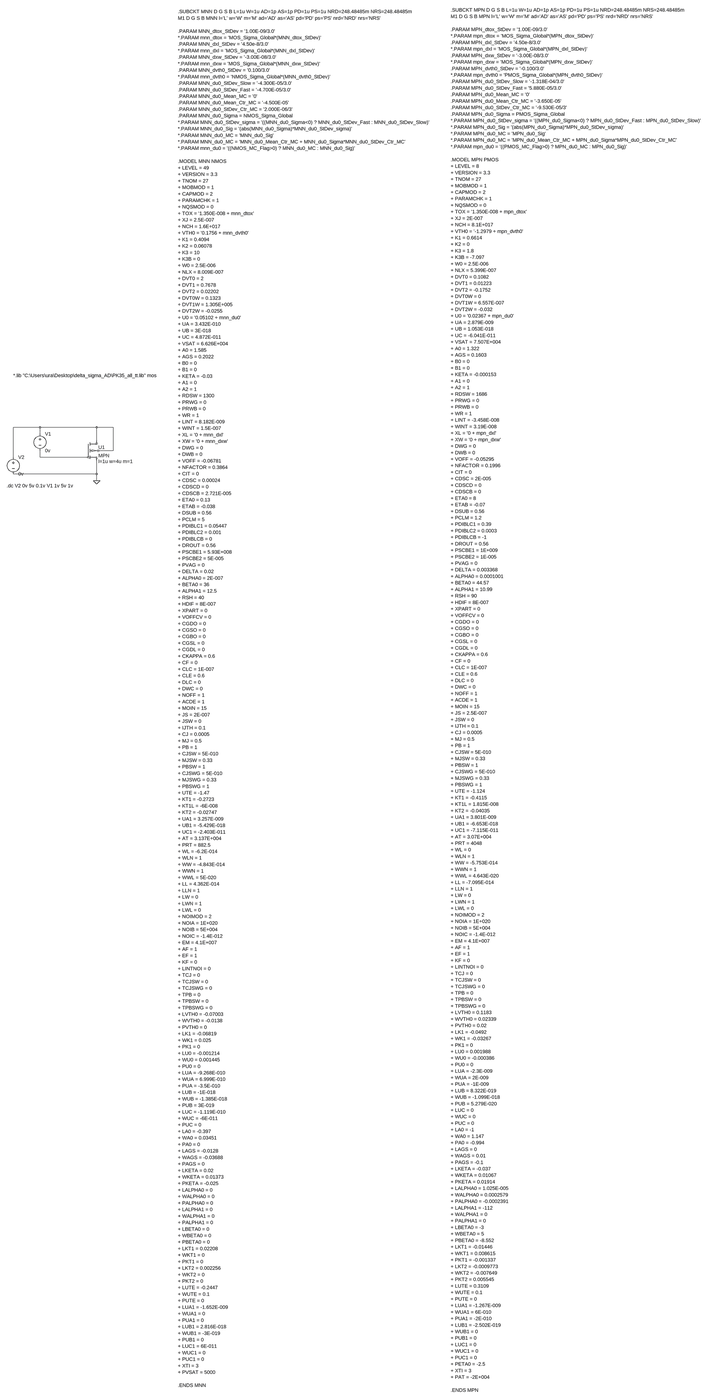
[diagram p0: schematic MPN_iv.asc, whole sheet]
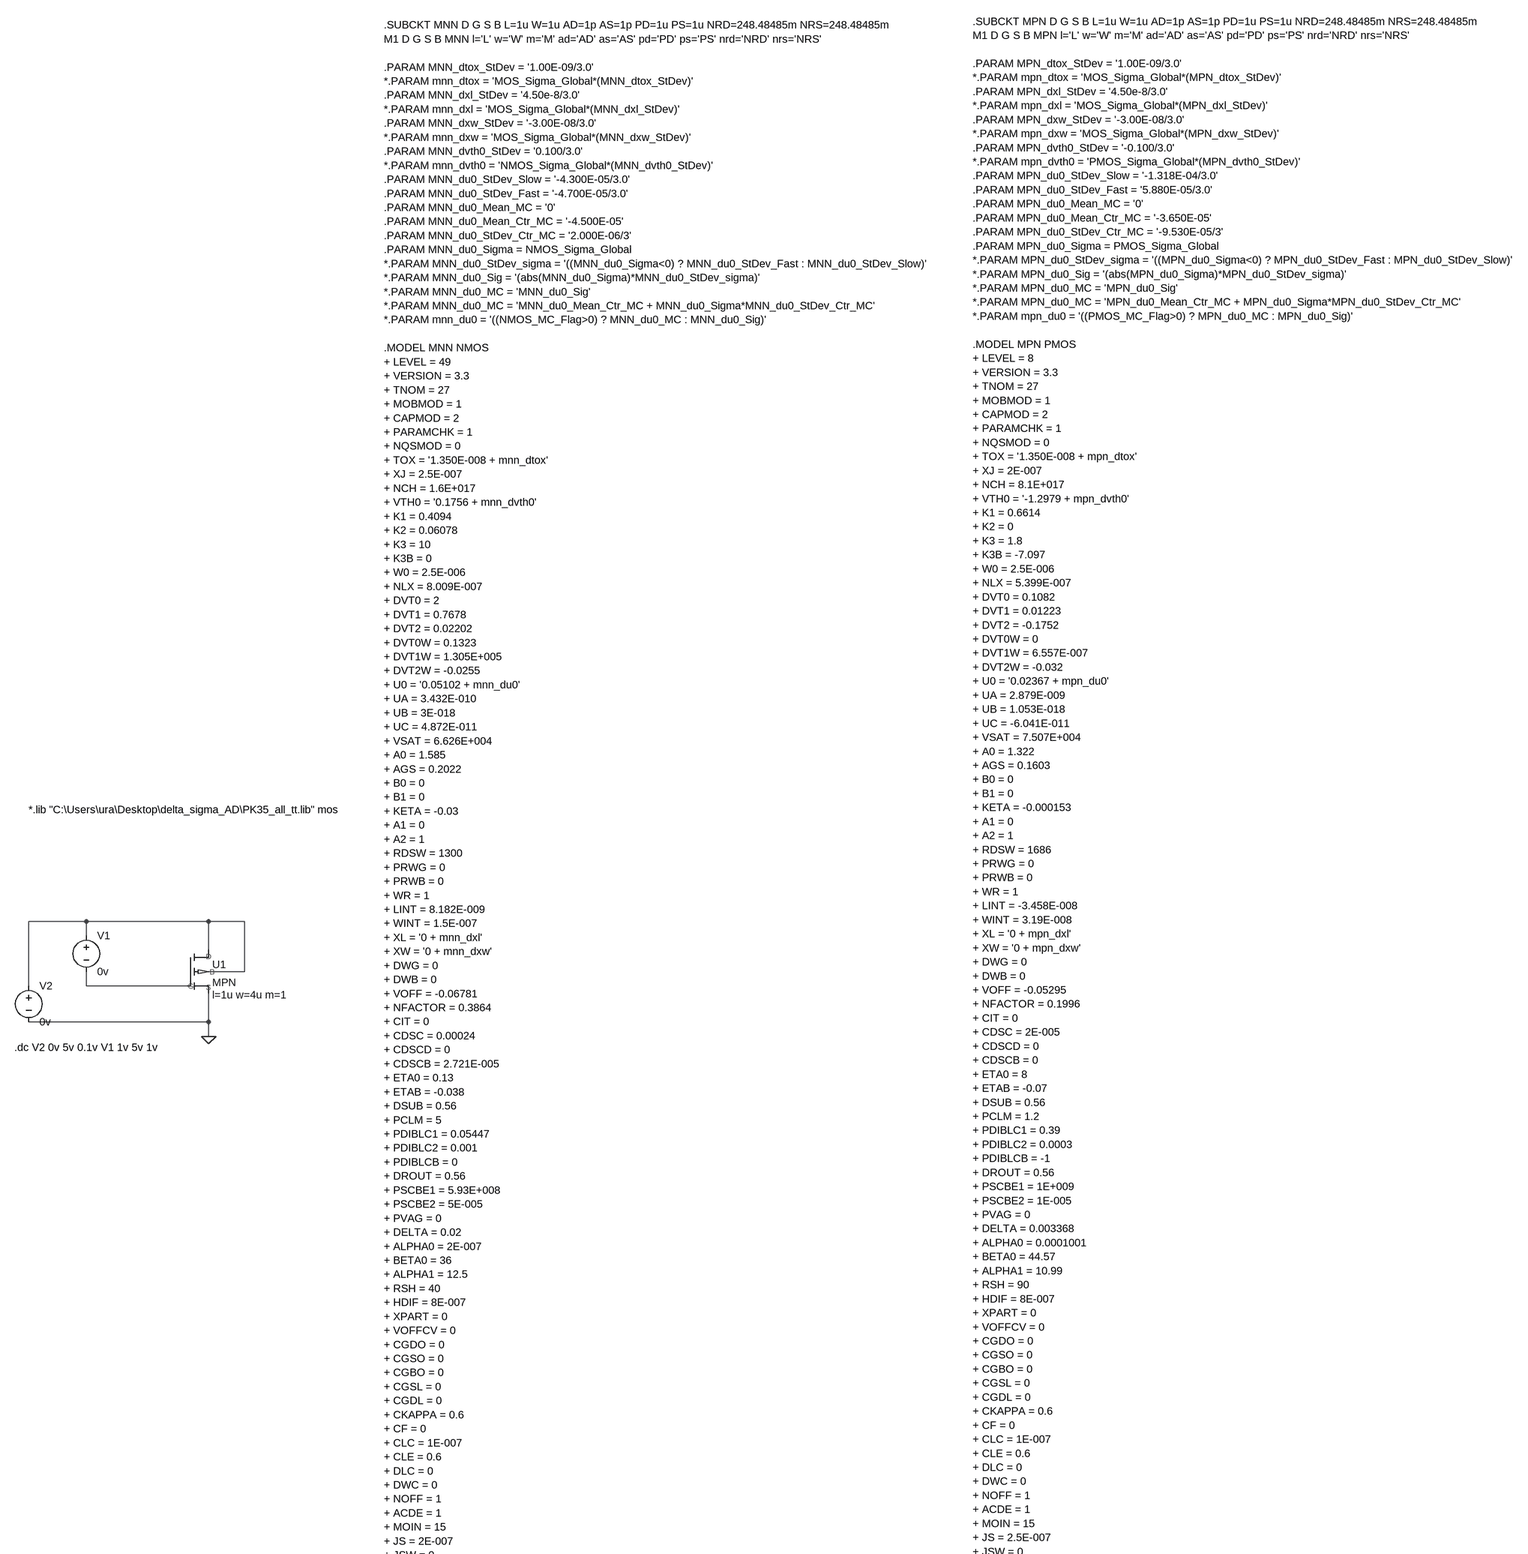
[diagram p1: schematic MPN_iv.asc, part, row 1 of 2, column 1 of 1]
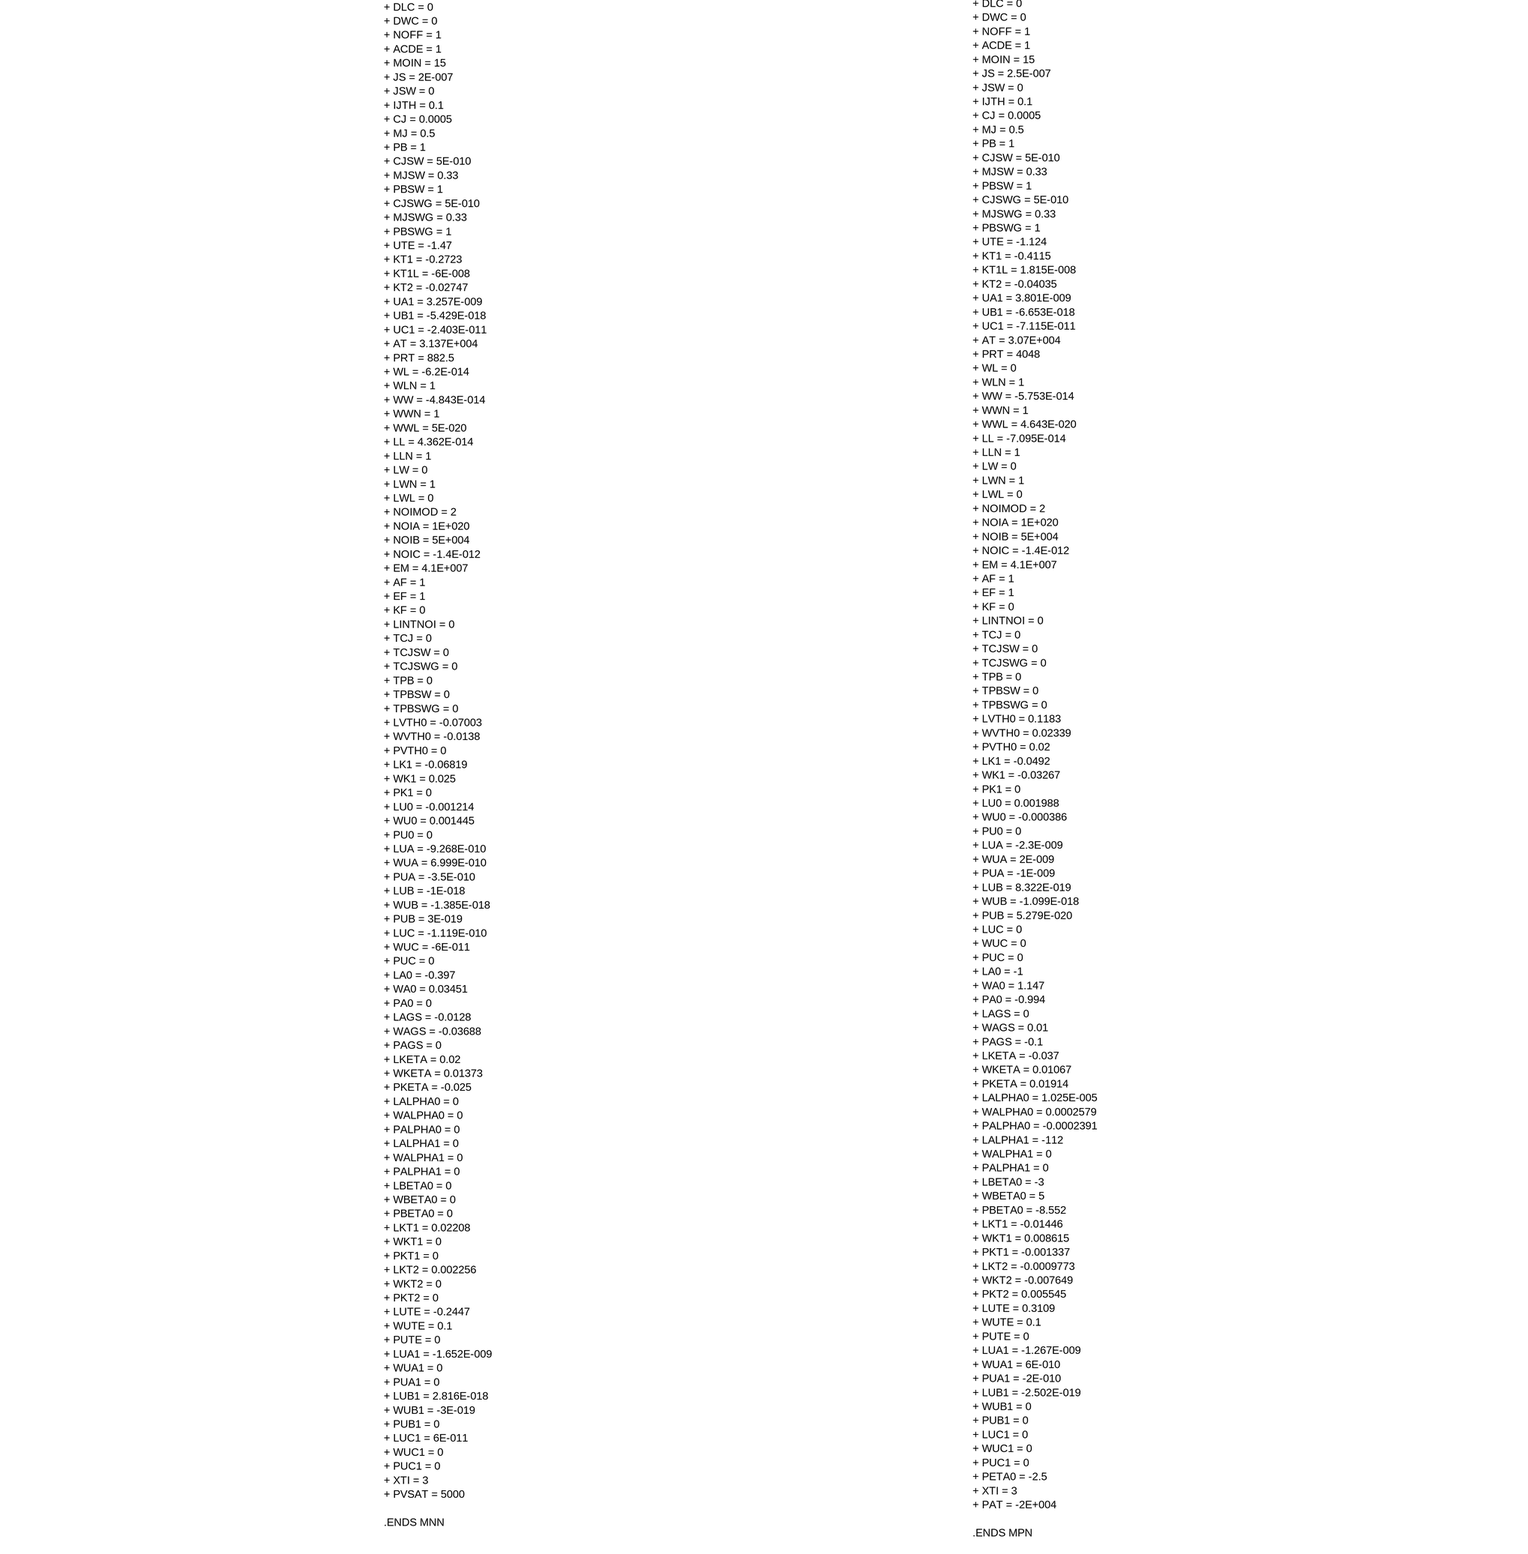
[diagram p2: schematic MPN_iv.asc, part, row 2 of 2, column 1 of 1]
MPN_iv.asc, the LTspice schematic file:
Version 4
SHEET 1 3700 4048
WIRE -160 96 -288 96
WIRE 112 96 -160 96
WIRE 192 96 112 96
WIRE -160 128 -160 96
WIRE 112 160 112 96
WIRE 192 208 192 96
WIRE 192 208 112 208
WIRE -288 240 -288 96
WIRE -160 240 -160 208
WIRE 64 240 -160 240
WIRE 112 320 112 256
WIRE 112 320 -288 320
WIRE 112 352 112 320
FLAG 112 352 0
SYMBOL voltage -160 112 R0
WINDOW 123 0 0 Left 0
WINDOW 39 0 0 Left 0
SYMATTR InstName V1
SYMATTR Value 0v
SYMBOL voltage -288 224 R0
WINDOW 123 0 0 Left 0
WINDOW 39 0 0 Left 0
SYMATTR InstName V2
SYMATTR Value 0v
SYMBOL MPN 96 208 R0
WINDOW 39 24 52 Left 2
SYMATTR InstName U1
SYMATTR SpiceLine l=1u w=4u m=1
TEXT -288 -152 Left 2 !*.lib "C:\\Users\\ura\\Desktop\\delta_sigma_AD\\PK35_all_tt.lib" mos
TEXT -320 376 Left 2 !.dc V2 0v 5v 0.1v V1 1v 5v 1v
TEXT 992 -1896 Left 2 !.SUBCKT MNN D G S B L=1u W=1u AD=1p AS=1p PD=1u PS=1u NRD=248.48485m NRS=248.48485m\nM1 D G S B MNN l='L' w='W' m='M' ad='AD' as='AS' pd='PD' ps='PS' nrd='NRD' nrs='NRS'\n \n.PARAM MNN_dtox_StDev = '1.00E-09/3.0'\n*.PARAM mnn_dtox = 'MOS_Sigma_Global*(MNN_dtox_StDev)'\n.PARAM MNN_dxl_StDev = '4.50e-8/3.0'\n*.PARAM mnn_dxl = 'MOS_Sigma_Global*(MNN_dxl_StDev)'\n.PARAM MNN_dxw_StDev = '-3.00E-08/3.0'\n*.PARAM mnn_dxw = 'MOS_Sigma_Global*(MNN_dxw_StDev)'\n.PARAM MNN_dvth0_StDev = '0.100/3.0'\n*.PARAM mnn_dvth0 = 'NMOS_Sigma_Global*(MNN_dvth0_StDev)'\n.PARAM MNN_du0_StDev_Slow = '-4.300E-05/3.0'\n.PARAM MNN_du0_StDev_Fast = '-4.700E-05/3.0'\n.PARAM MNN_du0_Mean_MC = '0'\n.PARAM MNN_du0_Mean_Ctr_MC = '-4.500E-05'\n.PARAM MNN_du0_StDev_Ctr_MC = '2.000E-06/3'\n.PARAM MNN_du0_Sigma = NMOS_Sigma_Global\n*.PARAM MNN_du0_StDev_sigma = '((MNN_du0_Sigma<0) ? MNN_du0_StDev_Fast : MNN_du0_StDev_Slow)'\n*.PARAM MNN_du0_Sig = '(abs(MNN_du0_Sigma)*MNN_du0_StDev_sigma)'\n*.PARAM MNN_du0_MC = 'MNN_du0_Sig'\n*.PARAM MNN_du0_MC = 'MNN_du0_Mean_Ctr_MC + MNN_du0_Sigma*MNN_du0_StDev_Ctr_MC'\n*.PARAM mnn_du0 = '((NMOS_MC_Flag>0) ? MNN_du0_MC : MNN_du0_Sig)'\n \n.MODEL MNN NMOS\n+ LEVEL = 49\n+ VERSION = 3.3\n+ TNOM = 27\n+ MOBMOD = 1\n+ CAPMOD = 2\n+ PARAMCHK = 1\n+ NQSMOD = 0\n+ TOX = '1.350E-008 + mnn_dtox'\n+ XJ = 2.5E-007\n+ NCH = 1.6E+017\n+ VTH0 = '0.1756 + mnn_dvth0'\n+ K1 = 0.4094\n+ K2 = 0.06078\n+ K3 = 10\n+ K3B = 0\n+ W0 = 2.5E-006\n+ NLX = 8.009E-007\n+ DVT0 = 2\n+ DVT1 = 0.7678\n+ DVT2 = 0.02202\n+ DVT0W = 0.1323\n+ DVT1W = 1.305E+005\n+ DVT2W = -0.0255\n+ U0 = '0.05102 + mnn_du0'\n+ UA = 3.432E-010\n+ UB = 3E-018\n+ UC = 4.872E-011\n+ VSAT = 6.626E+004\n+ A0 = 1.585\n+ AGS = 0.2022\n+ B0 = 0\n+ B1 = 0\n+ KETA = -0.03\n+ A1 = 0\n+ A2 = 1\n+ RDSW = 1300\n+ PRWG = 0\n+ PRWB = 0\n+ WR = 1\n+ LINT = 8.182E-009\n+ WINT = 1.5E-007\n+ XL = '0 + mnn_dxl'\n+ XW = '0 + mnn_dxw'\n+ DWG = 0\n+ DWB = 0\n+ VOFF = -0.06781\n+ NFACTOR = 0.3864\n+ CIT = 0\n+ CDSC = 0.00024\n+ CDSCD = 0\n+ CDSCB = 2.721E-005\n+ ETA0 = 0.13\n+ ETAB = -0.038\n+ DSUB = 0.56\n+ PCLM = 5\n+ PDIBLC1 = 0.05447\n+ PDIBLC2 = 0.001\n+ PDIBLCB = 0\n+ DROUT = 0.56\n+ PSCBE1 = 5.93E+008\n+ PSCBE2 = 5E-005\n+ PVAG = 0\n+ DELTA = 0.02\n+ ALPHA0 = 2E-007\n+ BETA0 = 36\n+ ALPHA1 = 12.5\n+ RSH = 40\n+ HDIF = 8E-007\n+ XPART = 0\n+ VOFFCV = 0\n+ CGDO = 0\n+ CGSO = 0\n+ CGBO = 0\n+ CGSL = 0\n+ CGDL = 0\n+ CKAPPA = 0.6\n+ CF = 0\n+ CLC = 1E-007\n+ CLE = 0.6\n+ DLC = 0\n+ DWC = 0\n+ NOFF = 1\n+ ACDE = 1\n+ MOIN = 15\n+ JS = 2E-007\n+ JSW = 0\n+ IJTH = 0.1\n+ CJ = 0.0005\n+ MJ = 0.5\n+ PB = 1\n+ CJSW = 5E-010\n+ MJSW = 0.33\n+ PBSW = 1\n+ CJSWG = 5E-010\n+ MJSWG = 0.33\n+ PBSWG = 1\n+ UTE = -1.47\n+ KT1 = -0.2723\n+ KT1L = -6E-008\n+ KT2 = -0.02747\n+ UA1 = 3.257E-009\n+ UB1 = -5.429E-018\n+ UC1 = -2.403E-011\n+ AT = 3.137E+004\n+ PRT = 882.5\n+ WL = -6.2E-014\n+ WLN = 1\n+ WW = -4.843E-014\n+ WWN = 1\n+ WWL = 5E-020\n+ LL = 4.362E-014\n+ LLN = 1\n+ LW = 0\n+ LWN = 1\n+ LWL = 0\n+ NOIMOD = 2\n+ NOIA = 1E+020\n+ NOIB = 5E+004\n+ NOIC = -1.4E-012\n+ EM = 4.1E+007\n+ AF = 1\n+ EF = 1\n+ KF = 0\n+ LINTNOI = 0\n+ TCJ = 0\n+ TCJSW = 0\n+ TCJSWG = 0\n+ TPB = 0\n+ TPBSW = 0\n+ TPBSWG = 0\n+ LVTH0 = -0.07003\n+ WVTH0 = -0.0138\n+ PVTH0 = 0\n+ LK1 = -0.06819\n+ WK1 = 0.025\n+ PK1 = 0\n+ LU0 = -0.001214\n+ WU0 = 0.001445\n+ PU0 = 0\n+ LUA = -9.268E-010\n+ WUA = 6.999E-010\n+ PUA = -3.5E-010\n+ LUB = -1E-018\n+ WUB = -1.385E-018\n+ PUB = 3E-019\n+ LUC = -1.119E-010\n+ WUC = -6E-011\n+ PUC = 0\n+ LA0 = -0.397\n+ WA0 = 0.03451\n+ PA0 = 0\n+ LAGS = -0.0128\n+ WAGS = -0.03688\n+ PAGS = 0\n+ LKETA = 0.02\n+ WKETA = 0.01373\n+ PKETA = -0.025\n+ LALPHA0 = 0\n+ WALPHA0 = 0\n+ PALPHA0 = 0\n+ LALPHA1 = 0\n+ WALPHA1 = 0\n+ PALPHA1 = 0\n+ LBETA0 = 0\n+ WBETA0 = 0\n+ PBETA0 = 0\n+ LKT1 = 0.02208\n+ WKT1 = 0\n+ PKT1 = 0\n+ LKT2 = 0.002256\n+ WKT2 = 0\n+ PKT2 = 0\n+ LUTE = -0.2447\n+ WUTE = 0.1\n+ PUTE = 0\n+ LUA1 = -1.652E-009\n+ WUA1 = 0\n+ PUA1 = 0\n+ LUB1 = 2.816E-018\n+ WUB1 = -3E-019\n+ PUB1 = 0\n+ LUC1 = 6E-011\n+ WUC1 = 0\n+ PUC1 = 0\n+ XTI = 3\n+ PVSAT = 5000\n \n.ENDS MNN
TEXT 2416 -1904 Left 2 !.SUBCKT MPN D G S B L=1u W=1u AD=1p AS=1p PD=1u PS=1u NRD=248.48485m NRS=248.48485m\nM1 D G S B MPN l='L' w='W' m='M' ad='AD' as='AS' pd='PD' ps='PS' nrd='NRD' nrs='NRS'\n \n.PARAM MPN_dtox_StDev = '1.00E-09/3.0'\n*.PARAM mpn_dtox = 'MOS_Sigma_Global*(MPN_dtox_StDev)'\n.PARAM MPN_dxl_StDev = '4.50e-8/3.0'\n*.PARAM mpn_dxl = 'MOS_Sigma_Global*(MPN_dxl_StDev)'\n.PARAM MPN_dxw_StDev = '-3.00E-08/3.0'\n*.PARAM mpn_dxw = 'MOS_Sigma_Global*(MPN_dxw_StDev)'\n.PARAM MPN_dvth0_StDev = '-0.100/3.0'\n*.PARAM mpn_dvth0 = 'PMOS_Sigma_Global*(MPN_dvth0_StDev)'\n.PARAM MPN_du0_StDev_Slow = '-1.318E-04/3.0'\n.PARAM MPN_du0_StDev_Fast = '5.880E-05/3.0'\n.PARAM MPN_du0_Mean_MC = '0'\n.PARAM MPN_du0_Mean_Ctr_MC = '-3.650E-05'\n.PARAM MPN_du0_StDev_Ctr_MC = '-9.530E-05/3'\n.PARAM MPN_du0_Sigma = PMOS_Sigma_Global\n*.PARAM MPN_du0_StDev_sigma = '((MPN_du0_Sigma<0) ? MPN_du0_StDev_Fast : MPN_du0_StDev_Slow)'\n*.PARAM MPN_du0_Sig = '(abs(MPN_du0_Sigma)*MPN_du0_StDev_sigma)'\n*.PARAM MPN_du0_MC = 'MPN_du0_Sig'\n*.PARAM MPN_du0_MC = 'MPN_du0_Mean_Ctr_MC + MPN_du0_Sigma*MPN_du0_StDev_Ctr_MC'\n*.PARAM mpn_du0 = '((PMOS_MC_Flag>0) ? MPN_du0_MC : MPN_du0_Sig)'\n \n.MODEL MPN PMOS\n+ LEVEL = 8\n+ VERSION = 3.3\n+ TNOM = 27\n+ MOBMOD = 1\n+ CAPMOD = 2\n+ PARAMCHK = 1\n+ NQSMOD = 0\n+ TOX = '1.350E-008 + mpn_dtox'\n+ XJ = 2E-007\n+ NCH = 8.1E+017\n+ VTH0 = '-1.2979 + mpn_dvth0'\n+ K1 = 0.6614\n+ K2 = 0\n+ K3 = 1.8\n+ K3B = -7.097\n+ W0 = 2.5E-006\n+ NLX = 5.399E-007\n+ DVT0 = 0.1082\n+ DVT1 = 0.01223\n+ DVT2 = -0.1752\n+ DVT0W = 0\n+ DVT1W = 6.557E-007\n+ DVT2W = -0.032\n+ U0 = '0.02367 + mpn_du0'\n+ UA = 2.879E-009\n+ UB = 1.053E-018\n+ UC = -6.041E-011\n+ VSAT = 7.507E+004\n+ A0 = 1.322\n+ AGS = 0.1603\n+ B0 = 0\n+ B1 = 0\n+ KETA = -0.000153\n+ A1 = 0\n+ A2 = 1\n+ RDSW = 1686\n+ PRWG = 0\n+ PRWB = 0\n+ WR = 1\n+ LINT = -3.458E-008\n+ WINT = 3.19E-008\n+ XL = '0 + mpn_dxl'\n+ XW = '0 + mpn_dxw'\n+ DWG = 0\n+ DWB = 0\n+ VOFF = -0.05295\n+ NFACTOR = 0.1996\n+ CIT = 0\n+ CDSC = 2E-005\n+ CDSCD = 0\n+ CDSCB = 0\n+ ETA0 = 8\n+ ETAB = -0.07\n+ DSUB = 0.56\n+ PCLM = 1.2\n+ PDIBLC1 = 0.39\n+ PDIBLC2 = 0.0003\n+ PDIBLCB = -1\n+ DROUT = 0.56\n+ PSCBE1 = 1E+009\n+ PSCBE2 = 1E-005\n+ PVAG = 0\n+ DELTA = 0.003368\n+ ALPHA0 = 0.0001001\n+ BETA0 = 44.57\n+ ALPHA1 = 10.99\n+ RSH = 90\n+ HDIF = 8E-007\n+ XPART = 0\n+ VOFFCV = 0\n+ CGDO = 0\n+ CGSO = 0\n+ CGBO = 0\n+ CGSL = 0\n+ CGDL = 0\n+ CKAPPA = 0.6\n+ CF = 0\n+ CLC = 1E-007\n+ CLE = 0.6\n+ DLC = 0\n+ DWC = 0\n+ NOFF = 1\n+ ACDE = 1\n+ MOIN = 15\n+ JS = 2.5E-007\n+ JSW = 0\n+ IJTH = 0.1\n+ CJ = 0.0005\n+ MJ = 0.5\n+ PB = 1\n+ CJSW = 5E-010\n+ MJSW = 0.33\n+ PBSW = 1\n+ CJSWG = 5E-010\n+ MJSWG = 0.33\n+ PBSWG = 1\n+ UTE = -1.124\n+ KT1 = -0.4115\n+ KT1L = 1.815E-008\n+ KT2 = -0.04035\n+ UA1 = 3.801E-009\n+ UB1 = -6.653E-018\n+ UC1 = -7.115E-011\n+ AT = 3.07E+004\n+ PRT = 4048\n+ WL = 0\n+ WLN = 1\n+ WW = -5.753E-014\n+ WWN = 1\n+ WWL = 4.643E-020\n+ LL = -7.095E-014\n+ LLN = 1\n+ LW = 0\n+ LWN = 1\n+ LWL = 0\n+ NOIMOD = 2\n+ NOIA = 1E+020\n+ NOIB = 5E+004\n+ NOIC = -1.4E-012\n+ EM = 4.1E+007\n+ AF = 1\n+ EF = 1\n+ KF = 0\n+ LINTNOI = 0\n+ TCJ = 0\n+ TCJSW = 0\n+ TCJSWG = 0\n+ TPB = 0\n+ TPBSW = 0\n+ TPBSWG = 0\n+ LVTH0 = 0.1183\n+ WVTH0 = 0.02339\n+ PVTH0 = 0.02\n+ LK1 = -0.0492\n+ WK1 = -0.03267\n+ PK1 = 0\n+ LU0 = 0.001988\n+ WU0 = -0.000386\n+ PU0 = 0\n+ LUA = -2.3E-009\n+ WUA = 2E-009\n+ PUA = -1E-009\n+ LUB = 8.322E-019\n+ WUB = -1.099E-018\n+ PUB = 5.279E-020\n+ LUC = 0\n+ WUC = 0\n+ PUC = 0\n+ LA0 = -1\n+ WA0 = 1.147\n+ PA0 = -0.994\n+ LAGS = 0\n+ WAGS = 0.01\n+ PAGS = -0.1\n+ LKETA = -0.037\n+ WKETA = 0.01067\n+ PKETA = 0.01914\n+ LALPHA0 = 1.025E-005\n+ WALPHA0 = 0.0002579\n+ PALPHA0 = -0.0002391\n+ LALPHA1 = -112\n+ WALPHA1 = 0\n+ PALPHA1 = 0\n+ LBETA0 = -3\n+ WBETA0 = 5\n+ PBETA0 = -8.552\n+ LKT1 = -0.01446\n+ WKT1 = 0.008615\n+ PKT1 = -0.001337\n+ LKT2 = -0.0009773\n+ WKT2 = -0.007649\n+ PKT2 = 0.005545\n+ LUTE = 0.3109\n+ WUTE = 0.1\n+ PUTE = 0\n+ LUA1 = -1.267E-009\n+ WUA1 = 6E-010\n+ PUA1 = -2E-010\n+ LUB1 = -2.502E-019\n+ WUB1 = 0\n+ PUB1 = 0\n+ LUC1 = 0\n+ WUC1 = 0\n+ PUC1 = 0\n+ PETA0 = -2.5\n+ XTI = 3\n+ PAT = -2E+004\n \n.ENDS MPN

The netlist it stands for:
* MPN_iv.asc
V1 N001 N002 0v
V2 N001 0 0v
XU1 N001 N002 0 N001 MPN l=1u w=4u m=1  ; pins D G S B
*.lib "C:\Users\ura\Desktop\delta_sigma_AD\PK35_all_tt.lib" mos
.dc V2 0v 5v 0.1v V1 1v 5v 1v
.SUBCKT MNN D G S B L=1u W=1u AD=1p AS=1p PD=1u PS=1u NRD=248.48485m NRS=248.48485m
M1 D G S B MNN l='L' w='W' m='M' ad='AD' as='AS' pd='PD' ps='PS' nrd='NRD' nrs='NRS'
.PARAM MNN_dtox_StDev = '1.00E-09/3.0'
*.PARAM mnn_dtox = 'MOS_Sigma_Global*(MNN_dtox_StDev)'
.PARAM MNN_dxl_StDev = '4.50e-8/3.0'
*.PARAM mnn_dxl = 'MOS_Sigma_Global*(MNN_dxl_StDev)'
.PARAM MNN_dxw_StDev = '-3.00E-08/3.0'
*.PARAM mnn_dxw = 'MOS_Sigma_Global*(MNN_dxw_StDev)'
.PARAM MNN_dvth0_StDev = '0.100/3.0'
*.PARAM mnn_dvth0 = 'NMOS_Sigma_Global*(MNN_dvth0_StDev)'
.PARAM MNN_du0_StDev_Slow = '-4.300E-05/3.0'
.PARAM MNN_du0_StDev_Fast = '-4.700E-05/3.0'
.PARAM MNN_du0_Mean_MC = '0'
.PARAM MNN_du0_Mean_Ctr_MC = '-4.500E-05'
.PARAM MNN_du0_StDev_Ctr_MC = '2.000E-06/3'
.PARAM MNN_du0_Sigma = NMOS_Sigma_Global
*.PARAM MNN_du0_StDev_sigma = '((MNN_du0_Sigma<0) ? MNN_du0_StDev_Fast : MNN_du0_StDev_Slow)'
*.PARAM MNN_du0_Sig = '(abs(MNN_du0_Sigma)*MNN_du0_StDev_sigma)'
*.PARAM MNN_du0_MC = 'MNN_du0_Sig'
*.PARAM MNN_du0_MC = 'MNN_du0_Mean_Ctr_MC + MNN_du0_Sigma*MNN_du0_StDev_Ctr_MC'
*.PARAM mnn_du0 = '((NMOS_MC_Flag>0) ? MNN_du0_MC : MNN_du0_Sig)'
.MODEL MNN NMOS
+ LEVEL = 49
+ VERSION = 3.3
+ TNOM = 27
+ MOBMOD = 1
+ CAPMOD = 2
+ PARAMCHK = 1
+ NQSMOD = 0
+ TOX = '1.350E-008 + mnn_dtox'
+ XJ = 2.5E-007
+ NCH = 1.6E+017
+ VTH0 = '0.1756 + mnn_dvth0'
+ K1 = 0.4094
+ K2 = 0.06078
+ K3 = 10
+ K3B = 0
+ W0 = 2.5E-006
+ NLX = 8.009E-007
+ DVT0 = 2
+ DVT1 = 0.7678
+ DVT2 = 0.02202
+ DVT0W = 0.1323
+ DVT1W = 1.305E+005
+ DVT2W = -0.0255
+ U0 = '0.05102 + mnn_du0'
+ UA = 3.432E-010
+ UB = 3E-018
+ UC = 4.872E-011
+ VSAT = 6.626E+004
+ A0 = 1.585
+ AGS = 0.2022
+ B0 = 0
+ B1 = 0
+ KETA = -0.03
+ A1 = 0
+ A2 = 1
+ RDSW = 1300
+ PRWG = 0
+ PRWB = 0
+ WR = 1
+ LINT = 8.182E-009
+ WINT = 1.5E-007
+ XL = '0 + mnn_dxl'
+ XW = '0 + mnn_dxw'
+ DWG = 0
+ DWB = 0
+ VOFF = -0.06781
+ NFACTOR = 0.3864
+ CIT = 0
+ CDSC = 0.00024
+ CDSCD = 0
+ CDSCB = 2.721E-005
+ ETA0 = 0.13
+ ETAB = -0.038
+ DSUB = 0.56
+ PCLM = 5
+ PDIBLC1 = 0.05447
+ PDIBLC2 = 0.001
+ PDIBLCB = 0
+ DROUT = 0.56
+ PSCBE1 = 5.93E+008
+ PSCBE2 = 5E-005
+ PVAG = 0
+ DELTA = 0.02
+ ALPHA0 = 2E-007
+ BETA0 = 36
+ ALPHA1 = 12.5
+ RSH = 40
+ HDIF = 8E-007
+ XPART = 0
+ VOFFCV = 0
+ CGDO = 0
+ CGSO = 0
+ CGBO = 0
+ CGSL = 0
+ CGDL = 0
+ CKAPPA = 0.6
+ CF = 0
+ CLC = 1E-007
+ CLE = 0.6
+ DLC = 0
+ DWC = 0
+ NOFF = 1
+ ACDE = 1
+ MOIN = 15
+ JS = 2E-007
+ JSW = 0
+ IJTH = 0.1
+ CJ = 0.0005
+ MJ = 0.5
+ PB = 1
+ CJSW = 5E-010
+ MJSW = 0.33
+ PBSW = 1
+ CJSWG = 5E-010
+ MJSWG = 0.33
+ PBSWG = 1
+ UTE = -1.47
+ KT1 = -0.2723
+ KT1L = -6E-008
+ KT2 = -0.02747
+ UA1 = 3.257E-009
+ UB1 = -5.429E-018
+ UC1 = -2.403E-011
+ AT = 3.137E+004
+ PRT = 882.5
+ WL = -6.2E-014
+ WLN = 1
+ WW = -4.843E-014
+ WWN = 1
+ WWL = 5E-020
+ LL = 4.362E-014
+ LLN = 1
+ LW = 0
+ LWN = 1
+ LWL = 0
+ NOIMOD = 2
+ NOIA = 1E+020
+ NOIB = 5E+004
+ NOIC = -1.4E-012
+ EM = 4.1E+007
+ AF = 1
+ EF = 1
+ KF = 0
+ LINTNOI = 0
+ TCJ = 0
+ TCJSW = 0
+ TCJSWG = 0
+ TPB = 0
+ TPBSW = 0
+ TPBSWG = 0
+ LVTH0 = -0.07003
+ WVTH0 = -0.0138
+ PVTH0 = 0
+ LK1 = -0.06819
+ WK1 = 0.025
+ PK1 = 0
+ LU0 = -0.001214
+ WU0 = 0.001445
+ PU0 = 0
+ LUA = -9.268E-010
+ WUA = 6.999E-010
+ PUA = -3.5E-010
+ LUB = -1E-018
+ WUB = -1.385E-018
+ PUB = 3E-019
+ LUC = -1.119E-010
+ WUC = -6E-011
+ PUC = 0
+ LA0 = -0.397
+ WA0 = 0.03451
+ PA0 = 0
+ LAGS = -0.0128
+ WAGS = -0.03688
+ PAGS = 0
+ LKETA = 0.02
+ WKETA = 0.01373
+ PKETA = -0.025
+ LALPHA0 = 0
+ WALPHA0 = 0
+ PALPHA0 = 0
+ LALPHA1 = 0
+ WALPHA1 = 0
+ PALPHA1 = 0
+ LBETA0 = 0
+ WBETA0 = 0
+ PBETA0 = 0
+ LKT1 = 0.02208
+ WKT1 = 0
+ PKT1 = 0
+ LKT2 = 0.002256
+ WKT2 = 0
+ PKT2 = 0
+ LUTE = -0.2447
+ WUTE = 0.1
+ PUTE = 0
+ LUA1 = -1.652E-009
+ WUA1 = 0
+ PUA1 = 0
+ LUB1 = 2.816E-018
+ WUB1 = -3E-019
+ PUB1 = 0
+ LUC1 = 6E-011
+ WUC1 = 0
+ PUC1 = 0
+ XTI = 3
+ PVSAT = 5000
.ENDS MNN
.SUBCKT MPN D G S B L=1u W=1u AD=1p AS=1p PD=1u PS=1u NRD=248.48485m NRS=248.48485m
M1 D G S B MPN l='L' w='W' m='M' ad='AD' as='AS' pd='PD' ps='PS' nrd='NRD' nrs='NRS'
.PARAM MPN_dtox_StDev = '1.00E-09/3.0'
*.PARAM mpn_dtox = 'MOS_Sigma_Global*(MPN_dtox_StDev)'
.PARAM MPN_dxl_StDev = '4.50e-8/3.0'
*.PARAM mpn_dxl = 'MOS_Sigma_Global*(MPN_dxl_StDev)'
.PARAM MPN_dxw_StDev = '-3.00E-08/3.0'
*.PARAM mpn_dxw = 'MOS_Sigma_Global*(MPN_dxw_StDev)'
.PARAM MPN_dvth0_StDev = '-0.100/3.0'
*.PARAM mpn_dvth0 = 'PMOS_Sigma_Global*(MPN_dvth0_StDev)'
.PARAM MPN_du0_StDev_Slow = '-1.318E-04/3.0'
.PARAM MPN_du0_StDev_Fast = '5.880E-05/3.0'
.PARAM MPN_du0_Mean_MC = '0'
.PARAM MPN_du0_Mean_Ctr_MC = '-3.650E-05'
.PARAM MPN_du0_StDev_Ctr_MC = '-9.530E-05/3'
.PARAM MPN_du0_Sigma = PMOS_Sigma_Global
*.PARAM MPN_du0_StDev_sigma = '((MPN_du0_Sigma<0) ? MPN_du0_StDev_Fast : MPN_du0_StDev_Slow)'
*.PARAM MPN_du0_Sig = '(abs(MPN_du0_Sigma)*MPN_du0_StDev_sigma)'
*.PARAM MPN_du0_MC = 'MPN_du0_Sig'
*.PARAM MPN_du0_MC = 'MPN_du0_Mean_Ctr_MC + MPN_du0_Sigma*MPN_du0_StDev_Ctr_MC'
*.PARAM mpn_du0 = '((PMOS_MC_Flag>0) ? MPN_du0_MC : MPN_du0_Sig)'
.MODEL MPN PMOS
+ LEVEL = 8
+ VERSION = 3.3
+ TNOM = 27
+ MOBMOD = 1
+ CAPMOD = 2
+ PARAMCHK = 1
+ NQSMOD = 0
+ TOX = '1.350E-008 + mpn_dtox'
+ XJ = 2E-007
+ NCH = 8.1E+017
+ VTH0 = '-1.2979 + mpn_dvth0'
+ K1 = 0.6614
+ K2 = 0
+ K3 = 1.8
+ K3B = -7.097
+ W0 = 2.5E-006
+ NLX = 5.399E-007
+ DVT0 = 0.1082
+ DVT1 = 0.01223
+ DVT2 = -0.1752
+ DVT0W = 0
+ DVT1W = 6.557E-007
+ DVT2W = -0.032
+ U0 = '0.02367 + mpn_du0'
+ UA = 2.879E-009
+ UB = 1.053E-018
+ UC = -6.041E-011
+ VSAT = 7.507E+004
+ A0 = 1.322
+ AGS = 0.1603
+ B0 = 0
+ B1 = 0
+ KETA = -0.000153
+ A1 = 0
+ A2 = 1
+ RDSW = 1686
+ PRWG = 0
+ PRWB = 0
+ WR = 1
+ LINT = -3.458E-008
+ WINT = 3.19E-008
+ XL = '0 + mpn_dxl'
+ XW = '0 + mpn_dxw'
+ DWG = 0
+ DWB = 0
+ VOFF = -0.05295
+ NFACTOR = 0.1996
+ CIT = 0
+ CDSC = 2E-005
+ CDSCD = 0
+ CDSCB = 0
+ ETA0 = 8
+ ETAB = -0.07
+ DSUB = 0.56
+ PCLM = 1.2
+ PDIBLC1 = 0.39
+ PDIBLC2 = 0.0003
+ PDIBLCB = -1
+ DROUT = 0.56
+ PSCBE1 = 1E+009
+ PSCBE2 = 1E-005
+ PVAG = 0
+ DELTA = 0.003368
+ ALPHA0 = 0.0001001
+ BETA0 = 44.57
+ ALPHA1 = 10.99
+ RSH = 90
+ HDIF = 8E-007
+ XPART = 0
+ VOFFCV = 0
+ CGDO = 0
+ CGSO = 0
+ CGBO = 0
+ CGSL = 0
+ CGDL = 0
+ CKAPPA = 0.6
+ CF = 0
+ CLC = 1E-007
+ CLE = 0.6
+ DLC = 0
+ DWC = 0
+ NOFF = 1
+ ACDE = 1
+ MOIN = 15
+ JS = 2.5E-007
+ JSW = 0
+ IJTH = 0.1
+ CJ = 0.0005
+ MJ = 0.5
+ PB = 1
+ CJSW = 5E-010
+ MJSW = 0.33
+ PBSW = 1
+ CJSWG = 5E-010
+ MJSWG = 0.33
+ PBSWG = 1
+ UTE = -1.124
+ KT1 = -0.4115
+ KT1L = 1.815E-008
+ KT2 = -0.04035
+ UA1 = 3.801E-009
+ UB1 = -6.653E-018
+ UC1 = -7.115E-011
+ AT = 3.07E+004
+ PRT = 4048
+ WL = 0
+ WLN = 1
+ WW = -5.753E-014
+ WWN = 1
+ WWL = 4.643E-020
+ LL = -7.095E-014
+ LLN = 1
+ LW = 0
+ LWN = 1
+ LWL = 0
+ NOIMOD = 2
+ NOIA = 1E+020
+ NOIB = 5E+004
+ NOIC = -1.4E-012
+ EM = 4.1E+007
+ AF = 1
+ EF = 1
+ KF = 0
+ LINTNOI = 0
+ TCJ = 0
+ TCJSW = 0
+ TCJSWG = 0
+ TPB = 0
+ TPBSW = 0
+ TPBSWG = 0
+ LVTH0 = 0.1183
+ WVTH0 = 0.02339
+ PVTH0 = 0.02
+ LK1 = -0.0492
+ WK1 = -0.03267
+ PK1 = 0
+ LU0 = 0.001988
+ WU0 = -0.000386
+ PU0 = 0
+ LUA = -2.3E-009
+ WUA = 2E-009
+ PUA = -1E-009
+ LUB = 8.322E-019
+ WUB = -1.099E-018
+ PUB = 5.279E-020
+ LUC = 0
+ WUC = 0
+ PUC = 0
+ LA0 = -1
+ WA0 = 1.147
+ PA0 = -0.994
+ LAGS = 0
+ WAGS = 0.01
+ PAGS = -0.1
+ LKETA = -0.037
+ WKETA = 0.01067
+ PKETA = 0.01914
+ LALPHA0 = 1.025E-005
+ WALPHA0 = 0.0002579
+ PALPHA0 = -0.0002391
+ LALPHA1 = -112
+ WALPHA1 = 0
+ PALPHA1 = 0
+ LBETA0 = -3
+ WBETA0 = 5
+ PBETA0 = -8.552
+ LKT1 = -0.01446
+ WKT1 = 0.008615
+ PKT1 = -0.001337
+ LKT2 = -0.0009773
+ WKT2 = -0.007649
+ PKT2 = 0.005545
+ LUTE = 0.3109
+ WUTE = 0.1
+ PUTE = 0
+ LUA1 = -1.267E-009
+ WUA1 = 6E-010
+ PUA1 = -2E-010
+ LUB1 = -2.502E-019
+ WUB1 = 0
+ PUB1 = 0
+ LUC1 = 0
+ WUC1 = 0
+ PUC1 = 0
+ PETA0 = -2.5
+ XTI = 3
+ PAT = -2E+004
.ENDS MPN
.backanno
.end